# EAGLE schematic M24C64 (EAGLE 6.1)
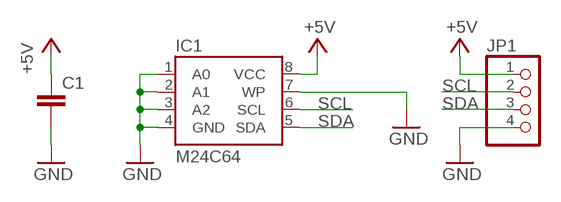
[diagram p0: schematic, sheet 1]

## Parts
C1  C-EUC0805K  [C0805K]
IC1  M24C64  AT24C  [SO08]
JP1  PINHD-1X4  [1X04]

## Nets
+5V: C1.1 IC1.8(VCC) JP1.1
GND: C1.2 IC1.1(A0) IC1.2(A1) IC1.3(A2) IC1.4(GND) IC1.7(WP) JP1.4
SCL: IC1.6(SCL) JP1.2
SDA: IC1.5(SDA) JP1.3

## Library data of the parts
C1 = mark_1:C-EU: CAPACITOR, European symbol
IC1 = mark_1:AT24C*: 2-wire serial EEPROM
JP1 = mark_1:PINHD-1X4: PIN HEADER